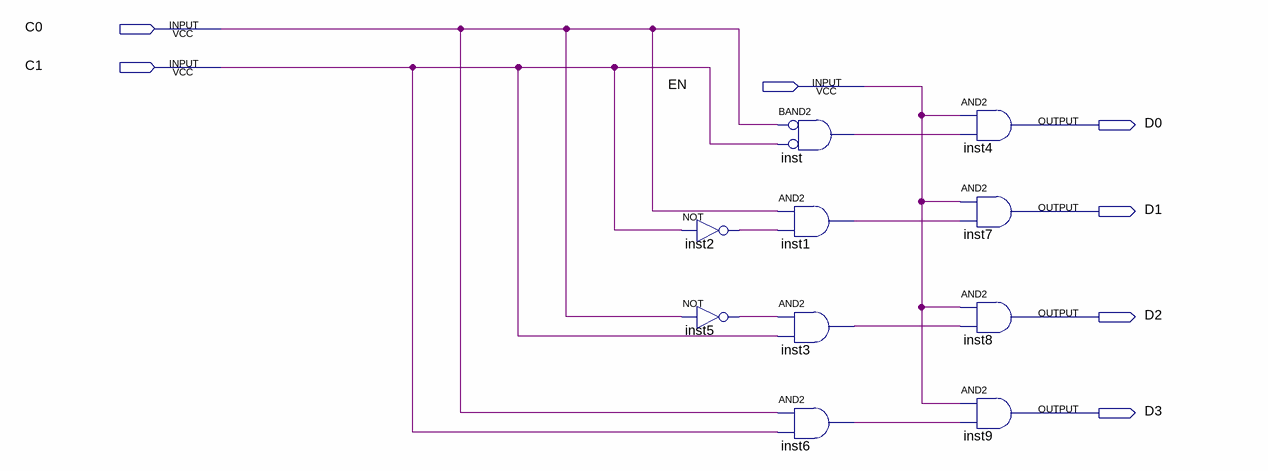
[diagram p0: schematic sheet]
// Quartus schematic decoder_2bits.bdf as structural Verilog: 10 symbols, 7 pins
module decoder_2bits (
  input  C0,
  input  C1,
  input  EN,
  output D0,
  output D1,
  output D2,
  output D3
);

  wire inst1_out, inst2_out, inst3_out, inst5_out, inst6_out, inst_out;

  not inst2 (inst2_out, C1);
  not inst5 (inst5_out, C0);
  and inst (inst_out, ~C0, ~C1);  // BAND2
  and inst1 (inst1_out, C0, inst2_out);
  and inst3 (inst3_out, inst5_out, C1);
  and inst6 (inst6_out, C0, C1);
  and inst4 (D0, EN, inst_out);
  and inst7 (D1, EN, inst1_out);
  and inst8 (D2, EN, inst3_out);
  and inst9 (D3, EN, inst6_out);
endmodule
